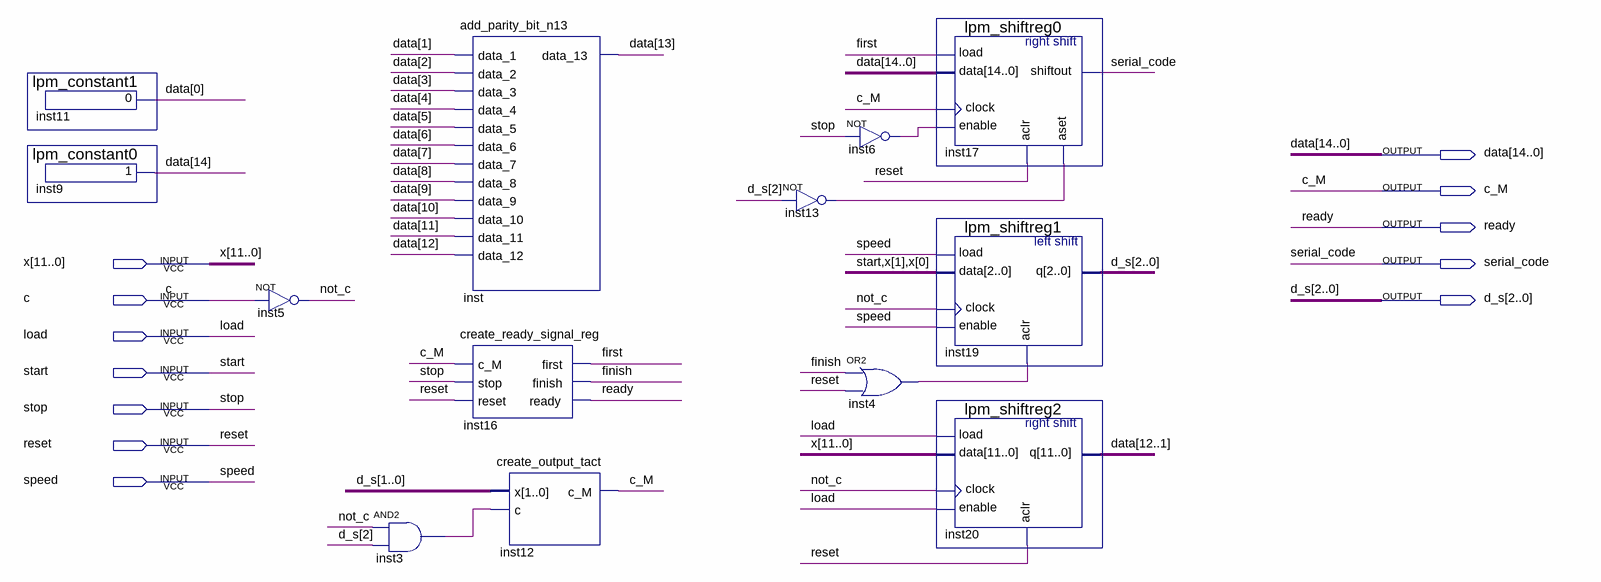
[diagram p0: schematic sheet]
// Quartus schematic Coursework.bdf as structural Verilog: 13 symbols, 12 pins
module Coursework (
  input  [11:0] x,
  input  c,
  input  load,
  input  start,
  input  stop,
  input  reset,
  input  speed,
  output [14:0] data,
  output c_M,
  output ready,
  output serial_code,
  output [2:0] d_s
);

  wire finish, first, inst3_out, inst4_out, inst6_out, inst13_out, not_c;

  lpm_constant1 inst11 (.result(data[0]));
  lpm_constant0 inst9 (.result(data[14]));
  not inst5 (not_c, c);
  and inst3 (inst3_out, not_c, d_s[2]);
  add_parity_bit_n13 inst (
    .data_1(data[1]), .data_2(data[2]), .data_3(data[3]), .data_4(data[4]), .data_5(data[5]),
    .data_6(data[6]), .data_7(data[7]), .data_8(data[8]), .data_9(data[9]), .data_10(data[10]),
    .data_11(data[11]), .data_12(data[12]), .data_13(data[13]));
  create_ready_signal_reg inst16 (.c_M(c_M), .stop(stop), .reset(reset), .first(first), .finish(finish), .ready(ready));
  create_output_tact inst12 (.x(d_s[1:0]), .c(inst3_out), .c_M(c_M));
  not inst13 (inst13_out, d_s[2]);
  not inst6 (inst6_out, stop);
  or inst4 (inst4_out, finish, reset);
  lpm_shiftreg0 inst17 (
    .load(first), .data(data), .clock(c_M), .enable(inst6_out), .aclr(reset), .aset(inst13_out),
    .shiftout(serial_code));
  lpm_shiftreg1 inst19 (.load(speed), .data({start, x[1:0]}), .clock(not_c), .enable(speed), .aclr(inst4_out), .q(d_s));
  lpm_shiftreg2 inst20 (.load(load), .data(x), .clock(not_c), .enable(load), .aclr(reset), .q(data[12:1]));
endmodule
